# EAGLE design PV1000_STM32_PCB (EAGLE 6.6.0)
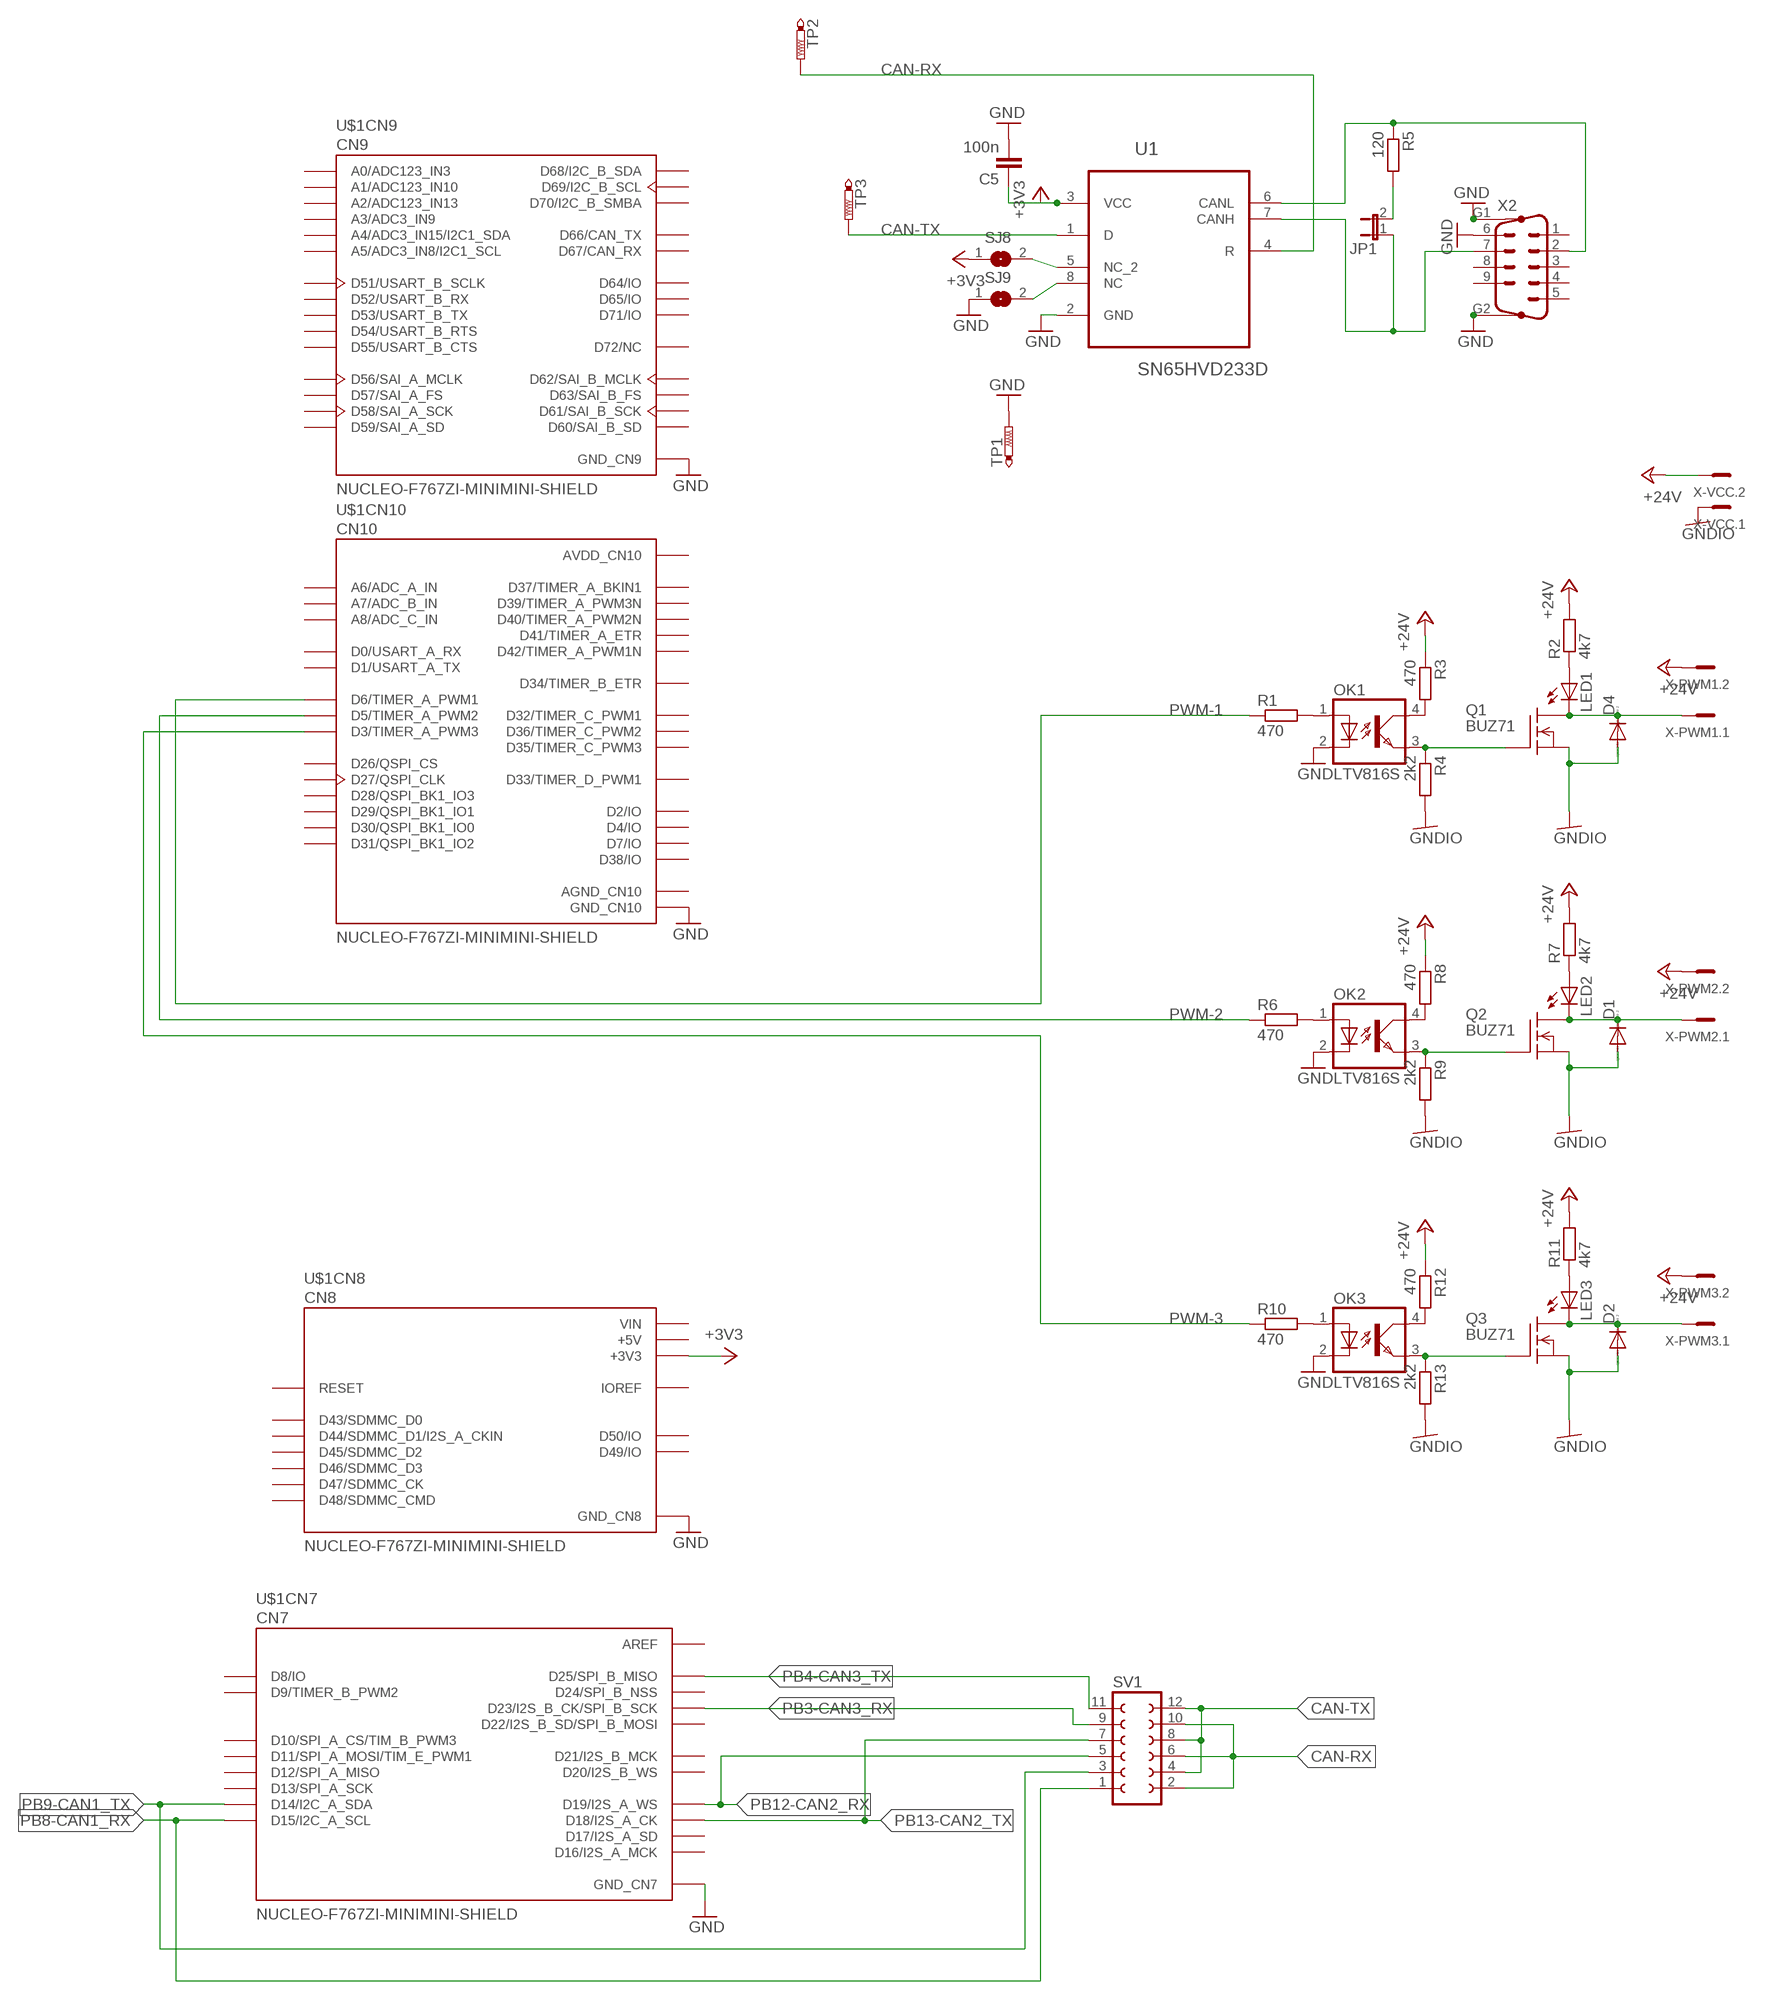
[diagram p0: schematic, sheet 1]

## Parts
C5  100n  C-EUC0805  [C0805]
D1  DIODE-D-5  [D-5]
D2  DIODE-D-5  [D-5]
D4  DIODE-D-5  [D-5]
JP1  JP1E  [JP1]
LED1  LEDCHIP-LED0805  [CHIP-LED0805]
LED2  LEDCHIP-LED0805  [CHIP-LED0805]
LED3  LEDCHIP-LED0805  [CHIP-LED0805]
OK1  LTV816S  [SMD4]
OK2  LTV816S  [SMD4]
OK3  LTV816S  [SMD4]
Q1  BUZ71  [TO220]
Q2  BUZ71  [TO220]
Q3  BUZ71  [TO220]
R1  470  R-EU_M0805  [M0805]
R2  4k7  R-EU_M0805  [M0805]
R3  470  R-EU_M0805  [M0805]
R4  2k2  R-EU_M0805  [M0805]
R5  120  R-EU_R0603  [R0603]
R6  470  R-EU_M0805  [M0805]
R7  4k7  R-EU_M0805  [M0805]
R8  470  R-EU_M0805  [M0805]
R9  2k2  R-EU_M0805  [M0805]
R10  470  R-EU_M0805  [M0805]
R11  4k7  R-EU_M0805  [M0805]
R12  470  R-EU_M0805  [M0805]
R13  2k2  R-EU_M0805  [M0805]
SJ8  SJ0603  [SJ0603]
SJ9  SJ0603  [SJ0603]
SV1  FE06-2  [FE06-2]
TP1  PTR1PAD1-13Y  [P1-13Y]
TP2  PTR1PAD1-13Y  [P1-13Y]
TP3  PTR1PAD1-13Y  [P1-13Y]
U1  SN65HVD233D  [SOIC127P600X175-8N]
U$1  NUCLEO-F767ZI-MINIMINI-SHIELD  [ST_NUCLEO-F767ZI-MIN]
X2  M09HPFARNELL  [M09HP-9_2]
X-PWM1  MC2  [MC2]
X-PWM2  MC2  [MC2]
X-PWM3  MC2  [MC2]
X-VCC  MC2  [MC2]

## Nets
+3V3: C5.1 SJ8.1 U1.3(VCC) U$1.CN8_7(CN8:+3V3)
+24V: R2.2 R3.1 R7.2 R8.1 R11.2 R12.1 X-PWM1.2 X-PWM2.2 X-PWM3.2 X-VCC.2
CAN-RX: SV1.2 SV1.6 SV1.10 TP2.TP U1.4(R)
CAN-TX: SV1.4 SV1.8 SV1.12 TP3.TP U1.1(D)
GND: C5.2 OK1.2(C) OK2.2(C) OK3.2(C) SJ9.1 TP1.TP U1.2(GND) U$1.CN7_8(CN7:GND_CN7) U$1.CN8_11(CN8:GND_CN8) U$1.CN8_13(CN8:GND_CN8) U$1.CN9_12(CN9:GND_CN9) U$1.CN9_23(CN9:GND_CN9) U$1.CN10_5(CN10:GND_CN10) U$1.CN10_17(CN10:GND_CN10) U$1.CN10_22(CN10:GND_CN10) U$1.CN10_27(CN10:GND_CN10) X2.6 X2.G1 X2.G2
GNDIO: D1.A D2.A D4.A Q1.3(S) Q2.3(S) Q3.3(S) R4.2 R9.2 R13.2 X-VCC.1
N$1: JP1.1 U1.7(CANH) X2.7
N$2: OK1.1(A) R1.2
N$3: SJ8.2 U1.5(NC_2)
N$4: LED1.A R2.1
N$5: OK1.4(COL) R3.2
N$6: OK1.3(EMIT) Q1.1(G) R4.1
N$7: SJ9.2 U1.8(NC)
N$8: D4.C LED1.C Q1.2(D) X-PWM1.1
N$9: OK2.1(A) R6.2
N$10: OK2.4(COL) R8.2
N$11: OK2.3(EMIT) Q2.1(G) R9.1
N$12: D1.C LED2.C Q2.2(D) X-PWM2.1
N$13: LED2.A R7.1
N$14: OK3.1(A) R10.2
N$15: OK3.4(COL) R12.2
N$16: OK3.3(EMIT) Q3.1(G) R13.1
N$17: D2.C LED3.C Q3.2(D) X-PWM3.1
N$18: JP1.2 R5.2
N$19: LED3.A R11.1
N$21: R5.1 U1.6(CANL) X2.2
PB3-CAN3_RX: SV1.9 U$1.CN7_15(CN7:D23/I2S_B_CK/SPI_B_SCK)
PB4-CAN3_TX: SV1.11 U$1.CN7_19(CN7:D25/SPI_B_MISO)
PB8-CAN1_RX: SV1.1 U$1.CN7_2(CN7:D15/I2C_A_SCL)
PB9-CAN1_TX: SV1.3 U$1.CN7_4(CN7:D14/I2C_A_SDA)
PB12-CAN2_RX: SV1.5 U$1.CN7_7(CN7:D19/I2S_A_WS)
PB13-CAN2_TX: SV1.7 U$1.CN7_5(CN7:D18/I2S_A_CK)
PWM-1: R1.1 U$1.CN10_4(CN10:D6/TIMER_A_PWM1)
PWM-2: R6.1 U$1.CN10_6(CN10:D5/TIMER_A_PWM2)
PWM-3: R10.1 U$1.CN10_10(CN10:D3/TIMER_A_PWM3)
Unconnected: U$1.CN7_1(CN7:D16/I2S_A_MCK) U$1.CN7_3(CN7:D17/I2S_A_SD) U$1.CN7_9(CN7:D20/I2S_B_WS) U$1.CN7_10(CN7:D13/SPI_A_SCK) U$1.CN7_11(CN7:D21/I2S_B_MCK) U$1.CN7_12(CN7:D12/SPI_A_MISO) U$1.CN7_13(CN7:D22/I2S_B_SD/SPI_B_MOSI) U$1.CN7_14(CN7:D11/SPI_A_MOSI/TIM_E_PWM1) U$1.CN7_16(CN7:D10/SPI_A_CS/TIM_B_PWM3) U$1.CN7_17(CN7:D24/SPI_B_NSS) U$1.CN7_18(CN7:D9/TIMER_B_PWM2) U$1.CN7_20(CN7:D8/IO) U$1.CN8_2(CN8:D43/SDMMC_D0) U$1.CN8_3(CN8:IOREF) U$1.CN8_4(CN8:D44/SDMMC_D1/I2S_A_CKIN) U$1.CN8_5(CN8:RESET) U$1.CN8_6(CN8:D45/SDMMC_D2) U$1.CN8_8(CN8:D46/SDMMC_D3) U$1.CN8_10(CN8:D47/SDMMC_CK) U$1.CN8_12(CN8:D48/SDMMC_CMD) U$1.CN8_14(CN8:D49/IO) U$1.CN8_16(CN8:D50/IO) U$1.CN9_1(CN9:A0/ADC123_IN3) U$1.CN9_2(CN9:D51/USART_B_SCLK) U$1.CN9_3(CN9:A1/ADC123_IN10) U$1.CN9_4(CN9:D52/USART_B_RX) U$1.CN9_5(CN9:A2/ADC123_IN13) U$1.CN9_6(CN9:D53/USART_B_TX) U$1.CN9_7(CN9:A3/ADC3_IN9) U$1.CN9_8(CN9:D54/USART_B_RTS) U$1.CN9_9(CN9:A4/ADC3_IN15/I2C1_SDA) U$1.CN9_10(CN9:D55/USART_B_CTS) U$1.CN9_11(CN9:A5/ADC3_IN8/I2C1_SCL) U$1.CN9_13(CN9:D72/NC) U$1.CN9_14(CN9:D56/SAI_A_MCLK) U$1.CN9_15(CN9:D71/IO) U$1.CN9_16(CN9:D57/SAI_A_FS) U$1.CN9_17(CN9:D70/I2C_B_SMBA) U$1.CN9_18(CN9:D58/SAI_A_SCK) U$1.CN9_19(CN9:D69/I2C_B_SCL) U$1.CN9_20(CN9:D59/SAI_A_SD) U$1.CN9_21(CN9:D68/I2C_B_SDA) U$1.CN9_22(CN9:D60/SAI_B_SD) U$1.CN9_24(CN9:D61/SAI_B_SCK) U$1.CN9_25(CN9:D67/CAN_RX) U$1.CN9_26(CN9:D62/SAI_B_MCLK) U$1.CN9_27(CN9:D66/CAN_TX) U$1.CN9_28(CN9:D63/SAI_B_FS) U$1.CN9_29(CN9:D65/IO) U$1.CN9_30(CN9:D64/IO) U$1.CN10_2(CN10:D7/IO) U$1.CN10_7(CN10:A6/ADC_A_IN) U$1.CN10_8(CN10:D4/IO) U$1.CN10_9(CN10:A7/ADC_B_IN) U$1.CN10_11(CN10:A8/ADC_C_IN) U$1.CN10_12(CN10:D2/IO) U$1.CN10_13(CN10:D26/QSPI_CS) U$1.CN10_14(CN10:D1/USART_A_TX) U$1.CN10_15(CN10:D27/QSPI_CLK) U$1.CN10_16(CN10:D0/USART_A_RX) U$1.CN10_18(CN10:D42/TIMER_A_PWM1N) U$1.CN10_19(CN10:D28/QSPI_BK1_IO3) U$1.CN10_20(CN10:D41/TIMER_A_ETR) U$1.CN10_21(CN10:D29/QSPI_BK1_IO1) U$1.CN10_23(CN10:D30/QSPI_BK1_IO0) U$1.CN10_24(CN10:D40/TIMER_A_PWM2N) U$1.CN10_25(CN10:D31/QSPI_BK1_IO2) U$1.CN10_26(CN10:D39/TIMER_A_PWM3N) U$1.CN10_28(CN10:D38/IO) U$1.CN10_29(CN10:D32/TIMER_C_PWM1) U$1.CN10_30(CN10:D37/TIMER_A_BKIN1) U$1.CN10_31(CN10:D33/TIMER_D_PWM1) U$1.CN10_32(CN10:D36/TIMER_C_PWM2) U$1.CN10_33(CN10:D34/TIMER_B_ETR) U$1.CN10_34(CN10:D35/TIMER_C_PWM3) X2.1 X2.3 X2.4 X2.5 X2.8 X2.9

## Power pins joined to a net without a drawn wire
+5V: U$1.CN8_9(CN8:+5V)
AGND_CN10: U$1.CN10_3(CN10:AGND_CN10)
AREF: U$1.CN7_6(CN7:AREF)
AVDD_CN10: U$1.CN10_1(CN10:AVDD_CN10)
VIN: U$1.CN8_15(CN8:VIN)

## Library data of the parts
C5 = rcl:C-EU: CAPACITOR, European symbol
D1 D2 D4 = diode:DIODE-: DIODE
JP1 = jumper:JP1E: JUMPER
LED1-LED3 = led:LED: LED OSRAM: - CHIPLED LG R971, LG N971, LY N971, LG Q971, LY Q971, LO R971, LY R971 LH N974, LH R974 LS Q976, LO Q976, LY Q976 LO Q996 - Hyper CHIPLED LW Q18S LB Q993, LB Q99A, LB R99A - SideLED LS A670, LO A670, LY A670, LG A670, LP A670 LB A673, LV A673, LT A673, LW A673 LH A674 LY A675 LS A676, LA A676, LO A676, LY A676, LW A676 LS A679, LY A679, LG A679 - Hyper Micro SIDELED® LS Y876, LA Y876, LO Y876, LY Y876 LT Y87S - SmartLED LW L88C, LW L88S LB L89C, LB L89S, LG L890 LS L89K, LO L89K, LY L89K LS L896, LA L896, LO L896, LY L896 - TOPLED LS T670, LO T670, LY T670, LG T670, LP T670 LSG T670, LSP T670, LSY T670, LOP T670, LYG T670 LG T671, LOG T671, LSG T671 LB T673, LV T673, LT T673, LW T673 LH T674 LS T676, LA T676, LO T676, LY T676, LB T676, LH T676, LSB T676, LW T676 LB T67C, LV T67C, LT T67C, LS T67K, LO T67K, LY T67K, LW E67C LS E67B, LA E67B, LO E67B, LY E67B, LB E67C, LV E67C, LT E67C LW T67C LS T679, LY T679, LG T679 LS T770, LO T770, LY T770, LG T770, LP T770 LB T773, LV T773, LT T773, LW T773 LH T774 LS E675, LA E675, LY E675, LS T675 LS T776, LA T776, LO T776, LY T776, LB T776 LHGB T686 LT T68C, LB T68C - Hyper Mini TOPLED® LB M676 - Mini TOPLED Santana® LG M470 LS M47K, LO M47K, LY M47K Source: http://www.osram.convergy.de LUXEON: - LUMILED® LXK2-PW12-R00, LXK2-PW12-S00, LXK2-PW14-U00, LXK2-PW14-V00 LXK2-PM12-R00, LXK2-PM12-S00, LXK2-PM14-U00 LXK2-PE12-Q00, LXK2-PE12-R00, LXK2-PE12-S00, LXK2-PE14-T00, LXK2-PE14-U00 LXK2-PB12-K00, LXK2-PB12-L00, LXK2-PB12-M00, LXK2-PB14-N00, LXK2-PB14-P00, LXK2-PB14-Q00 LXK2-PR12-L00, LXK2-PR12-M00, LXK2-PR14-Q00, LXK2-PR14-R00 LXK2-PD12-Q00, LXK2-PD12-R00, LXK2-PD12-S00 LXK2-PH12-R00, LXK2-PH12-S00 LXK2-PL12-P00, LXK2-PL12-Q00, LXK2-PL12-R00 Source: www.luxeon.com KINGBRIGHT: KA-3528ASYC Source: www.kingbright.com
OK1-OK3 = optocoupler:LTV816: OPTO COUPLER Source: LITEON, LTV816.pdf; OC_FARNELL: unknown; OC_NEWARK: unknown
Q1-Q3 = transistor-fet:BUZ71: N-Channel Enhancement MOSFET 50V; 14A; 0,1Ohm
R1-R13 = rcl:R-EU_: RESISTOR, European symbol
SJ8 SJ9 = jumper:SJ: SMD solder JUMPER
SV1 = con-lsta:FE06-2: FEMALE HEADER; OC_FARNELL: unknown; OC_NEWARK: unknown
TP1-TP3 = testpad:PTR1: TEST PIN
U1 = Texas Instruments_By_element14_Batch_1:SN65HVD233D: 3.3-V CAN TRANSCEIVERS; MPN: SN65HVD233D; OC_FARNELL: 1207268; OC_NEWARK: 54H4289; PACKAGE: SOIC-8; SUPPLIER: Texas Instruments
U$1 = NUCLEO-F767ZI-E7:NUCLEO-F767ZI-MINI: Nucleo Header Board Arduino Compatible
X2 = con-subd_mod:M09HP: SUB-D
X-PWM1-X-PWM3 X-VCC = con-phoenix-381_l:MC2: Mini-Combicon 3.81mm horizontal 2-polig (ohne Gegenstecker)

## Board
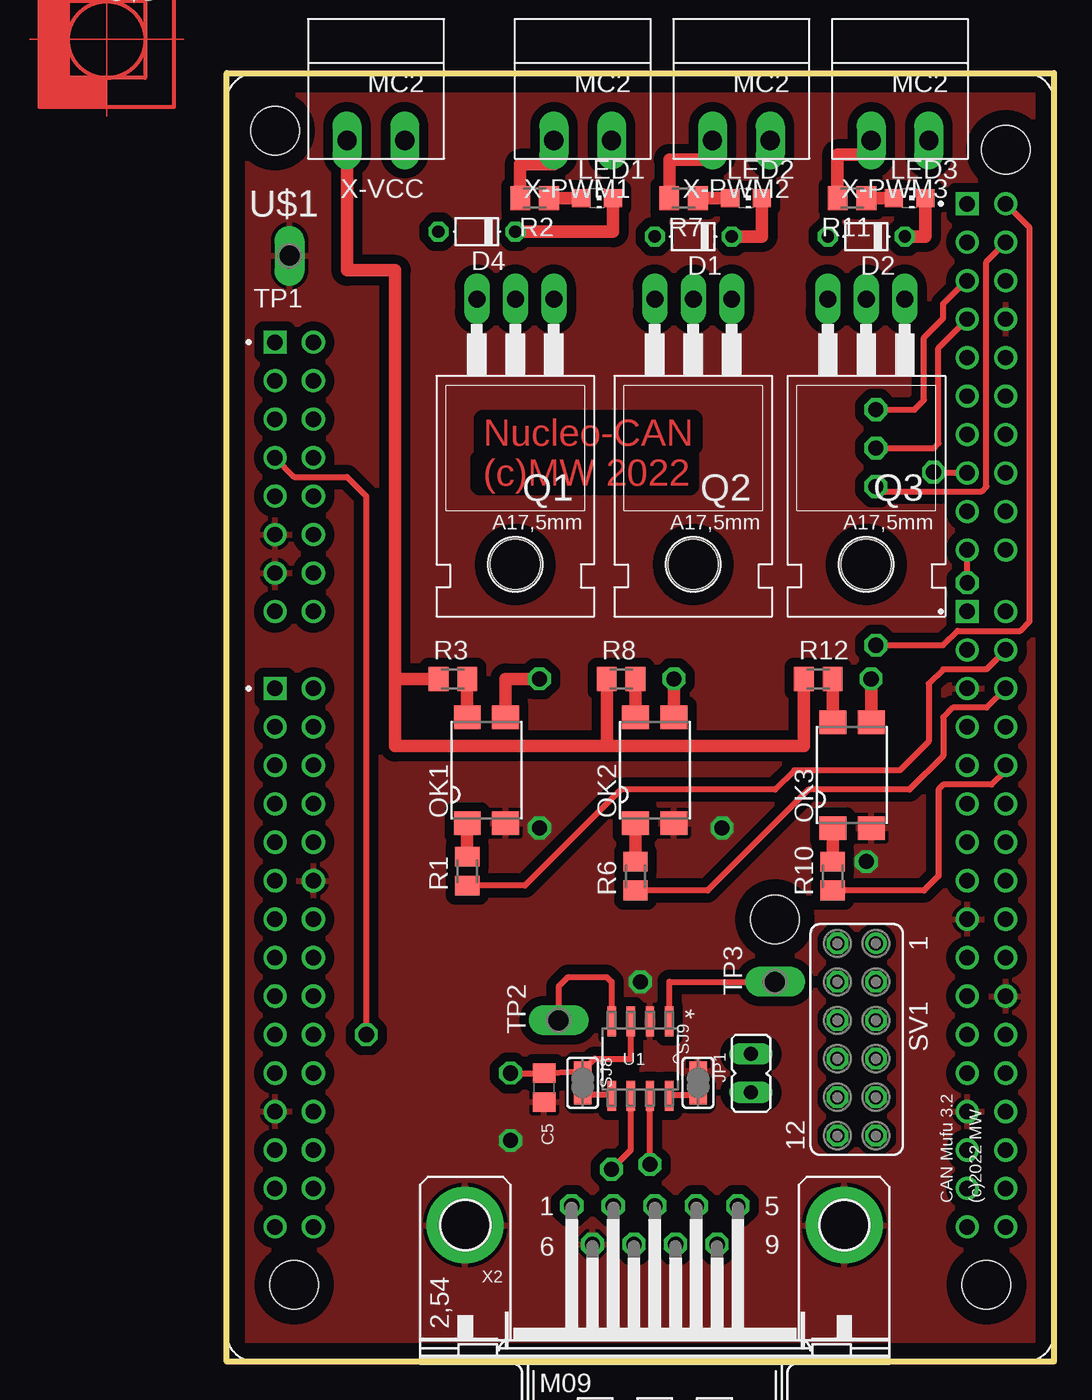
[diagram p1: board, top side]
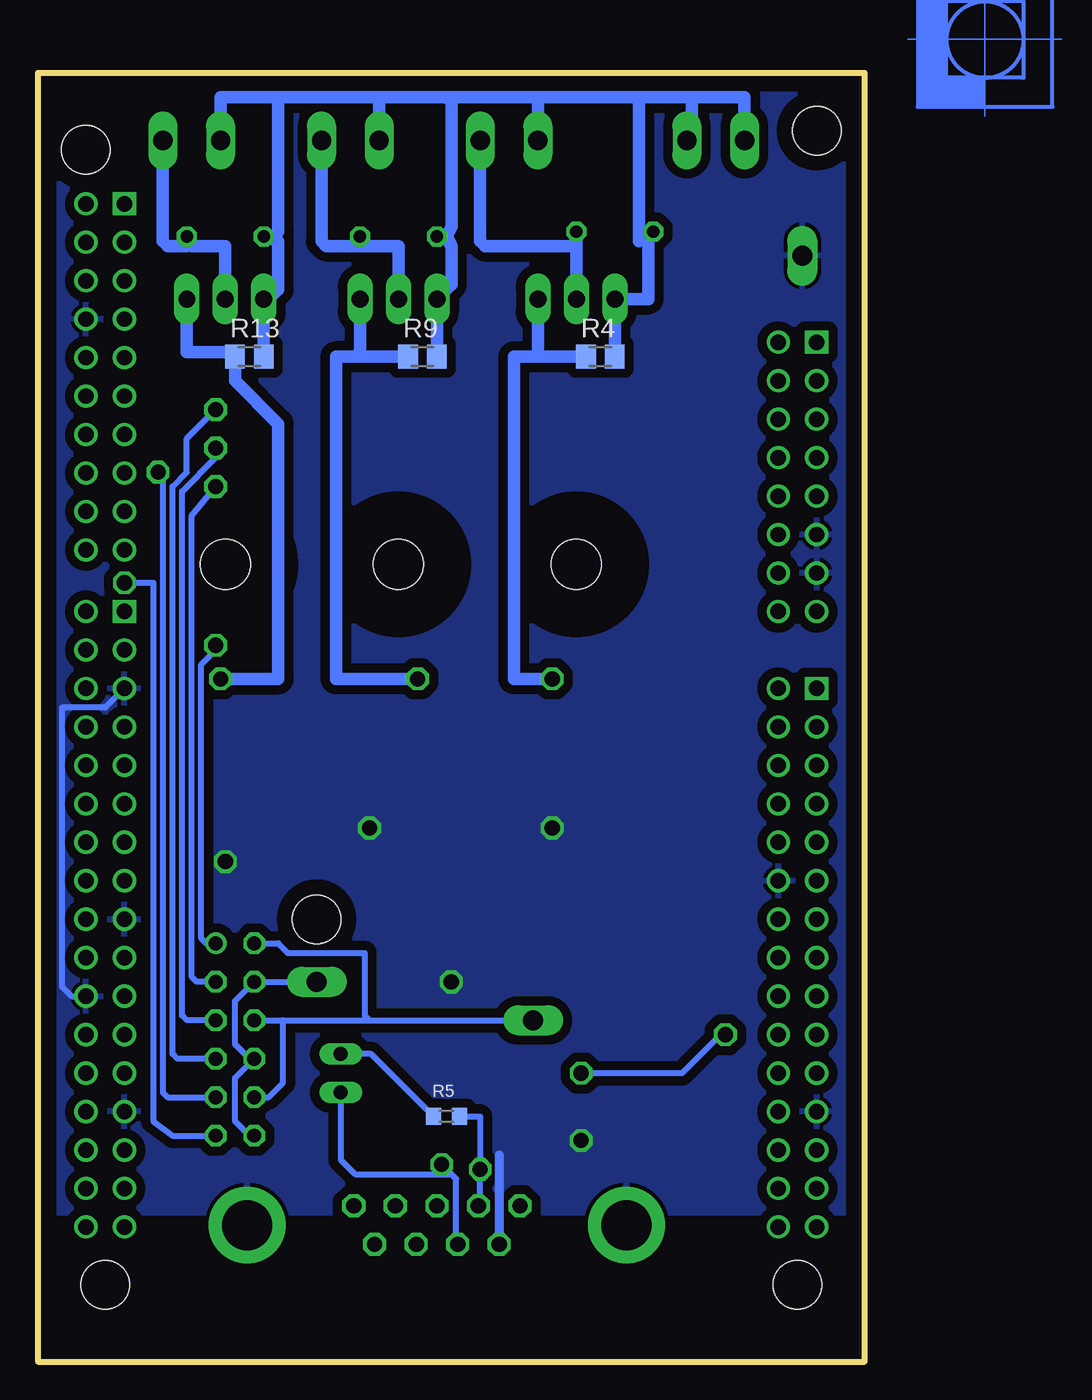
[diagram p2: board, bottom side, seen from below]

Size 54.61 x 85.09 mm. Coordinates in mm from the lower left corner, seen from the top.
Outline: 0,0 0,85.09 54.61,85.09 54.61,0 0,0
Copper layers (1*16): Top 0.035mm / dielectric 1.5mm / Bottom 0.035mm
Design rules "default": minimum track width 10mil, minimum drill 24mil, track to track 8mil, track to pad 8mil, pad to pad 8mil, via to via 8mil, smd to smd 8mil, copper to edge 40mil, drill to drill 8mil, minimum pad ring 10mil, minimum via ring 8mil, stop-mask expansion 4mil, vias tented up to drill 0mil, thermal gap 10mil
vRestrict: area 88.3,48.7 to 88.9,50.2; area 88.3,47.6 to 88.9,49.1; area 89,46.1 to 90.8,51.7; 3 lines

### Footprints (pad centres in the part's own frame; a part is rotated, then mirrored left to right if it is on the bottom)
C0805 = smd 1.3 x 1.5: 1 -0.95,0; 2 0.95,0
D-5 = drill 0.813 octagon: A 2.54,0; C -2.54,0
JP1 = drill 0.914 long: 1 0,-1.27; 2 0,1.27
CHIP-LED0805 = smd 1.2 x 1.2: A 0,-1.05; C 0,1.05
SMD4 = smd 1.78 x 1.55: 1 -1.27,-3.5; 2 1.27,-3.5; 3 1.27,3.5; 4 -1.27,3.5
TO220 = drill 1.118 long: 1 -2.54,-6.35; 2 0,-6.35; 3 2.54,-6.35 | hole 3.302: 0,11.176
M0805 = smd 1.3 x 1.6: 1 -0.95,0; 2 0.95,0
R0603 = smd 1 x 1.1: 1 -0.85,0; 2 0.85,0
SJ0603 = smd 1.27 x 1.143: 1 -0.794,0; 2 0.794,0
FE06-2 = drill 0.914: 1 -6.35,1.27 | drill 0.914 octagon: 2 -6.35,-1.27; 3 -3.81,1.27; 4 -3.81,-1.27; 5 -1.27,1.27; 6 -1.27,-1.27; 7 1.27,1.27; 8 1.27,-1.27; 9 3.81,1.27; 10 3.81,-1.27; 11 6.35,1.27; 12 6.35,-1.27
P1-13Y = drill 1.321 pad 1.905 long: TP 0,0
SOIC127P600X175-8N = smd 1.981 x 0.559: 1 -2.464,1.905; 2 -2.464,0.635; 3 -2.464,-0.635; 4 -2.464,-1.905; 5 2.464,-1.905; 6 2.464,-0.635; 7 2.464,0.635; 8 2.464,1.905
ST_NUCLEO-F767ZI-MIN = drill 1.02 square: CN7_1 21.59,33.914; CN8_1 -24.13,24.77; CN9_1 -24.13,1.91; CN10_1 21.59,6.99 | drill 1.02: CN7_2 24.13,33.914; CN7_3 21.59,31.374; CN7_4 24.13,31.374; CN7_5 21.59,28.834; CN7_6 24.13,28.834; CN7_7 21.59,26.294; CN7_8 24.13,26.294; CN7_9 21.59,23.754; CN7_10 24.13,23.754; CN7_11 21.59,21.214; CN7_12 24.13,21.214; CN7_13 21.59,18.674; CN7_14 24.13,18.674; CN7_15 21.59,16.134; CN7_16 24.13,16.134; CN7_17 21.59,13.594; CN7_18 24.13,13.594; CN7_19 21.59,11.054; CN7_20 24.13,11.054; CN8_2 -21.59,24.77; CN8_3 -24.13,22.23; CN8_4 -21.59,22.23; CN8_5 -24.13,19.69; CN8_6 -21.59,19.69; CN8_7 -24.13,17.15; CN8_8 -21.59,17.15; CN8_9 -24.13,14.61; CN8_10 -21.59,14.61; CN8_11 -24.13,12.07; CN8_12 -21.59,12.07; CN8_13 -24.13,9.53; CN8_14 -21.59,9.53; CN8_15 -24.13,6.99; CN8_16 -21.59,6.99; CN9_2 -21.59,1.91; CN9_3 -24.13,-0.63; CN9_4 -21.59,-0.63; CN9_5 -24.13,-3.17; CN9_6 -21.59,-3.17; CN9_7 -24.13,-5.71; CN9_8 -21.59,-5.71; CN9_9 -24.13,-8.25; CN9_10 -21.59,-8.25; CN9_11 -24.13,-10.79; CN9_12 -21.59,-10.79; CN9_13 -24.13,-13.33; CN9_14 -21.59,-13.33; CN9_15 -24.13,-15.87; CN9_16 -21.59,-15.87; CN9_17 -24.13,-18.41; CN9_18 -21.59,-18.41; CN9_19 -24.13,-20.95; CN9_20 -21.59,-20.95; CN9_21 -24.13,-23.49; CN9_22 -21.59,-23.49; CN9_23 -24.13,-26.03; CN9_24 -21.59,-26.03; CN9_25 -24.13,-28.57; CN9_26 -21.59,-28.57; CN9_27 -24.13,-31.11; CN9_28 -21.59,-31.11; CN9_29 -24.13,-33.65; CN9_30 -21.59,-33.65; CN10_2 24.13,6.99; CN10_3 21.59,4.45; CN10_4 24.13,4.45; CN10_5 21.59,1.91; CN10_6 24.13,1.91; CN10_7 21.59,-0.63; CN10_8 24.13,-0.63; CN10_9 21.59,-3.17; CN10_10 24.13,-3.17; CN10_11 21.59,-5.71; CN10_12 24.13,-5.71; CN10_13 21.59,-8.25; CN10_14 24.13,-8.25; CN10_15 21.59,-10.79; CN10_16 24.13,-10.79; CN10_17 21.59,-13.33; CN10_18 24.13,-13.33; CN10_19 21.59,-15.87; CN10_20 24.13,-15.87; CN10_21 21.59,-18.41; CN10_22 24.13,-18.41; CN10_23 21.59,-20.95; CN10_24 24.13,-20.95; CN10_25 21.59,-23.49; CN10_26 24.13,-23.49; CN10_27 21.59,-26.03; CN10_28 24.13,-26.03; CN10_29 21.59,-28.57; CN10_30 24.13,-28.57; CN10_31 21.59,-31.11; CN10_32 24.13,-31.11; CN10_33 21.59,-33.65; CN10_34 24.13,-33.65 | hole 3.2: -22.86,-37.46; 22.86,-37.46; 24.13,37.47; 8.89,-13.33; -24.13,38.74
M09HP-9_2 = drill 1.016 octagon: 1 -17.869,11.43; 2 -15.126,11.43; 3 -12.383,11.43; 4 -9.639,11.43; 5 -6.896,11.43; 6 -16.497,8.89; 7 -13.754,8.89; 8 -11.011,8.89; 9 -8.268,8.89 | drill 3.302 pad 5.08: G1 -24.905,10.16; G2 0.14,10.16
MC2 = drill 1.27 long: 1 -1.905,0; 2 1.905,0

### Placement (x,y rotation side)
C5  20.96,18.1 270 top
D1  30.8,74.3 180 top
D2  42.23,74.3 180 top
D4  16.51,74.61 180 top
JP1  34.61,19.05 0 top
LED1  24.45,76.83 270 top
LED2  34.29,76.83 270 top
LED3  45.09,76.83 270 top
OK1  17.14,39.05 0 top
OK2  28.26,39.05 0 top
OK3  41.27,38.73 0 top
Q1  19.05,63.82 180 top
Q2  30.8,63.82 180 top
Q3  42.23,63.82 180 top
R1  15.87,32.38 90 top
R2  20.32,76.83 180 top
R3  14.92,45.09 0 top
R4  17.46,66.36 0 bottom
R5  27.62,16.19 180 bottom
R6  26.99,32.07 90 top
R7  30.16,76.83 180 top
R8  26.04,45.09 0 top
R9  29.21,66.36 0 bottom
R10  40,32.07 90 top
R11  41.27,76.83 180 top
R12  39.05,45.09 0 top
R13  40.64,66.36 0 bottom
SJ8  23.5,18.41 270 top
SJ9  31.12,18.41 270 top
SV1  41.59,21.27 270 top
TP1  4.13,73.03 180 top
TP2  21.91,22.54 90 top
TP3  36.2,25.08 90 top
U1  27.3,20 270 top
U$1  27.3,42.55 0 top
U$2  [PASSMARK]  -11.11,-9.84 0 top  (outside the outline)
U$3  [PASSMARK]  77.79,-9.84 0 top  (outside the outline)
U$4  [PASSMARK]  84.45,76.2 0 top  (outside the outline)
U$5  [PASSMARK]  -7.94,87.31 0 top  (outside the outline)
U$6  [PASSMARK]  -22.86,53.98 0 top  (outside the outline)
X2  40.64,-1.14 0 top
X-PWM1  23.5,80.64 180 top
X-PWM2  33.97,80.64 180 top
X-PWM3  44.45,80.64 180 top
X-VCC  9.84,80.64 180 top

### Tracks (layer width: path | path; a pad name or v marks a point on that pad's centre or on a via)
+3V3  (via drill 1)
  Top 0.406: U1.3 26.67,20 24.29,20 SJ8.1 C5.1 v18.73,19.05 | U$1.CN8_7 4.45,58.42 7.94,58.42 9.21,57.15 v9.21,21.59
  Bottom 0.406: v9.21,21.59 9.52,21.59 12.07,19.05 v18.73,19.05
+24V
  Top 0.813: X-PWM2.2 32.07,79.38 29.21,79.38 R7.2 | X-PWM3.2 42.54,79.69 40.32,79.69 R11.2 | X-PWM1.2 21.59,79.06 19.37,79.06 R2.2 | R3.1 11.11,45.09 | 11.11,45.09 11.11,72.07 7.94,72.07 X-VCC.2 | R8.1 25.08,40.64 | 25.08,40.64 11.11,40.64 11.11,45.09 | R12.1 38.1,40.64 25.08,40.64
  Bottom 0.813: X-PWM1.2 21.59,83.5 | 21.59,83.5 7.94,83.5 X-VCC.2 | X-PWM2.2 32.07,83.5 | 32.07,83.5 21.59,83.5 | X-PWM3.2 42.54,83.5 32.07,83.5
CAN-RX
  Top 0.406: U1.4 25.4,25.08 25.08,25.4 22.54,25.4 21.91,24.77 TP2.TP
  Bottom 0.406: SV1.6 38.42,22.54 | 38.42,22.54 32.7,22.54 | 32.7,22.54 TP2.TP | SV1.2 38.74,27.62 38.1,26.99 33.02,26.99 33.02,22.86 32.7,22.54 | SV1.10 39.37,17.46 38.42,18.41 38.42,22.54
CAN-TX
  Top 0.406: U1.1 29.21,25.08 TP3.TP
  Bottom 0.406: 35.88,25.08 TP3.TP SV1.4 41.59,23.81 41.59,20.95 40.64,20 SV1.8 41.59,18.73 41.59,15.88 40.64,14.92 SV1.12
GND  (via drill 1)
  Bottom 0.406: U$1.CN10_5 50.17,43.18 53.02,43.18 53.02,24.77 52.39,24.13 U$1.CN10_22
  Bottom 0.61: X2.6 24.13,7.76 24.13,13.65
  other vias: 27.3,25.08 18.73,14.61 32.7,35.24 42.23,33.02 20.64,35.24
  pour Top (isolate 0.61): -8.89,83.82 96.84,83.82 96.84,1.27 -8.89,1.27
  pour Bottom (isolate 0.61): -13.97,87.31 -13.97,9.84 103.51,9.84 103.51,87.31
GNDIO
  Bottom 0.813: 27.62,74.3 27.3,73.66 27.3,71.12 Q2.3 R9.2 | 14.29,74.61 14.29,70.17 Q1.3 R4.2 | R13.2 Q3.3 39.37,70.17 38.74,70.8 38.74,73.98 D2.A 39.05,74.3 38.74,74.61 38.74,83.19 39.05,83.5 | 39.05,83.5 39.69,83.5 | 39.05,83.5 27.62,83.5 | 27.62,83.5 14.6,83.5 | 14.6,83.5 11.43,83.5 11.43,80.64 X-VCC.1 | D4.A 14.29,74.61 | 14.29,74.61 14.92,73.98 14.92,83.19 14.6,83.5 | D1.A 27.62,74.3 | 27.62,74.3 27.3,74.93 27.3,83.19 27.62,83.5
N$1  (via drill 1)
  Top 0.406: v27.94,13.02 U1.7
  Bottom 0.406: X2.7 26.99,7.85 26.99,12.06 27.3,12.38 | 27.3,12.38 v27.94,13.02 | JP1.1 34.61,13.34 33.65,12.38 27.3,12.38
N$2
  Top 0.813: R1.2 OK1.1
N$3
  Top 0.406: U1.5 25.32,17.62 SJ8.2
N$4
  Top 0.813: R2.1 LED1.A
N$5
  Top 0.813: OK1.4 R3.2
N$6  (via drill 1)
  Top 0.813: OK1.3 18.42,45.09 v20.64,45.09
  Bottom 0.813: Q1.1 21.59,66.36 | 21.59,66.36 R4.1 | v20.64,45.09 23.18,45.09 23.18,66.36 21.59,66.36
N$7
  Top 0.406: U1.8 29.29,17.62 SJ9.2
N$8
  Top 0.813: LED1.C 25.5,74.61 D4.C
  Bottom 0.813: X-PWM1.1 25.4,73.98 25.08,73.66 19.05,73.66 D4.C Q1.2
N$9
  Top 0.813: R6.2 OK2.1
N$10
  Top 0.813: OK2.4 R8.2
N$11  (via drill 1)
  Top 0.813: OK2.3 v29.53,45.09
  Bottom 0.813: Q2.1 33.34,66.67 33.65,66.36 | 33.65,66.36 34.92,66.36 34.92,45.09 v29.53,45.09 | 33.65,66.36 R9.1
N$12
  Top 0.813: LED2.C 35.34,74.3 D1.C
  Bottom 0.813: X-PWM2.1 35.88,73.98 35.56,73.66 33.65,73.66 | D1.C 33.65,73.66 | 33.65,73.66 30.8,73.66 Q2.2
N$13
  Top 0.813: LED2.A R7.1
N$14
  Top 0.813: R10.2 OK3.1
N$15
  Top 0.813: OK3.4 R12.2
N$16  (via drill 1)
  Top 0.813: OK3.3 v42.54,45.09
  Bottom 0.813: Q3.1 44.77,66.67 41.59,66.67 | 41.59,66.67 R13.1 | v42.54,45.09 38.74,45.09 38.74,61.91 41.59,64.77 41.59,66.67
N$17
  Top 0.813: LED3.C 46.14,74.3 D2.C
  Bottom 0.813: X-PWM3.1 46.35,73.98 46.04,73.66 44.77,73.66 D2.C 44.77,73.98 44.45,73.66 42.23,73.66 Q3.2
N$18
  Bottom 0.406: R5.2 32.6,20.32 JP1.2
N$19
  Top 0.813: R11.1 LED3.A
N$21  (via drill 1)
  Top 0.406: v25.4,12.7 26.67,13.97 U1.6
  Bottom 0.406: X2.2 25.4,10.4 v25.4,12.7 25.4,16.19 R5.1
PB3-CAN3_RX  (via drill 1)
  Top 0.406: U$1.CN7_15 46.73,58.68 v46.67,58.74
  Bottom 0.406: v46.67,58.74 46.35,58.42 46.35,17.78 46.04,17.46 SV1.9
PB4-CAN3_TX  (via drill 1)
  Top 0.406: U$1.CN7_19 48.84,53.28 v48.89,51.44
  Bottom 0.406: v48.89,51.44 46.99,51.44 46.99,15.88 45.72,14.92 SV1.11
PB8-CAN1_RX  (via drill 1)
  Top 0.406: U$1.CN7_2 53.02,74.87 53.02,48.9 52.39,48.26 48.26,48.26 47.31,47.31 v42.86,47.31
  Bottom 0.406: SV1.1 43.5,27.62 43.82,27.94 43.82,46.04 42.86,46.99 v42.86,47.31
PB9-CAN1_TX  (via drill 1)
  Top 0.406: v42.86,57.78 42.86,57.47 49.85,57.47 50.17,57.78 50.17,72.65 U$1.CN7_4
  Bottom 0.406: SV1.3 44.13,25.08 44.45,25.4 44.45,55.88 v42.86,57.78
PB12-CAN2_RX  (via drill 1)
  Top 0.406: v42.86,60.33 46.67,60.33 46.99,60.64 46.99,66.93 U$1.CN7_7
  Bottom 0.406: SV1.5 44.77,22.54 45.09,22.86 45.09,57.47 42.86,59.69 v42.86,60.33
PB13-CAN2_TX  (via drill 1)
  Top 0.406: v42.86,62.87 45.4,62.87 46.04,63.5 46.04,67.63 47.31,68.9 47.31,69.85 48.58,71.12 48.64,71.12 U$1.CN7_5
  Bottom 0.406: SV1.7 45.4,20 45.72,20.32 45.72,57.78 44.77,58.74 44.77,60.96 v42.86,62.87
PWM-1
  Top 0.406: U$1.CN10_4 50.17,45.72 47.31,45.72 46.35,44.77 46.35,40.96 44.45,39.05 37.46,39.05 36.2,37.78 26.03,37.78 19.69,31.43 R1.1
PWM-2
  Top 0.406: U$1.CN10_6 50.17,43.18 47.94,43.18 47.31,42.55 47.31,40.01 45.09,37.78 38.42,37.78 31.75,31.11 R6.1
PWM-3
  Top 0.406: U$1.CN10_10 51.43,39.05 50.48,38.1 47.31,38.1 46.99,37.78 46.99,32.07 46.04,31.11 R10.1

### Text on the board
Top: Nucleo-CAN | (c)MW 2022 | TOP
Bottom: Bottom
tNames: CAN Mufu 3.2 | (c)2022 MW